# Altium schematic sheet DUT_ATMEGA328P-AU.SchDoc
size A4; SheetNumber: 1; SheetTotal: 1
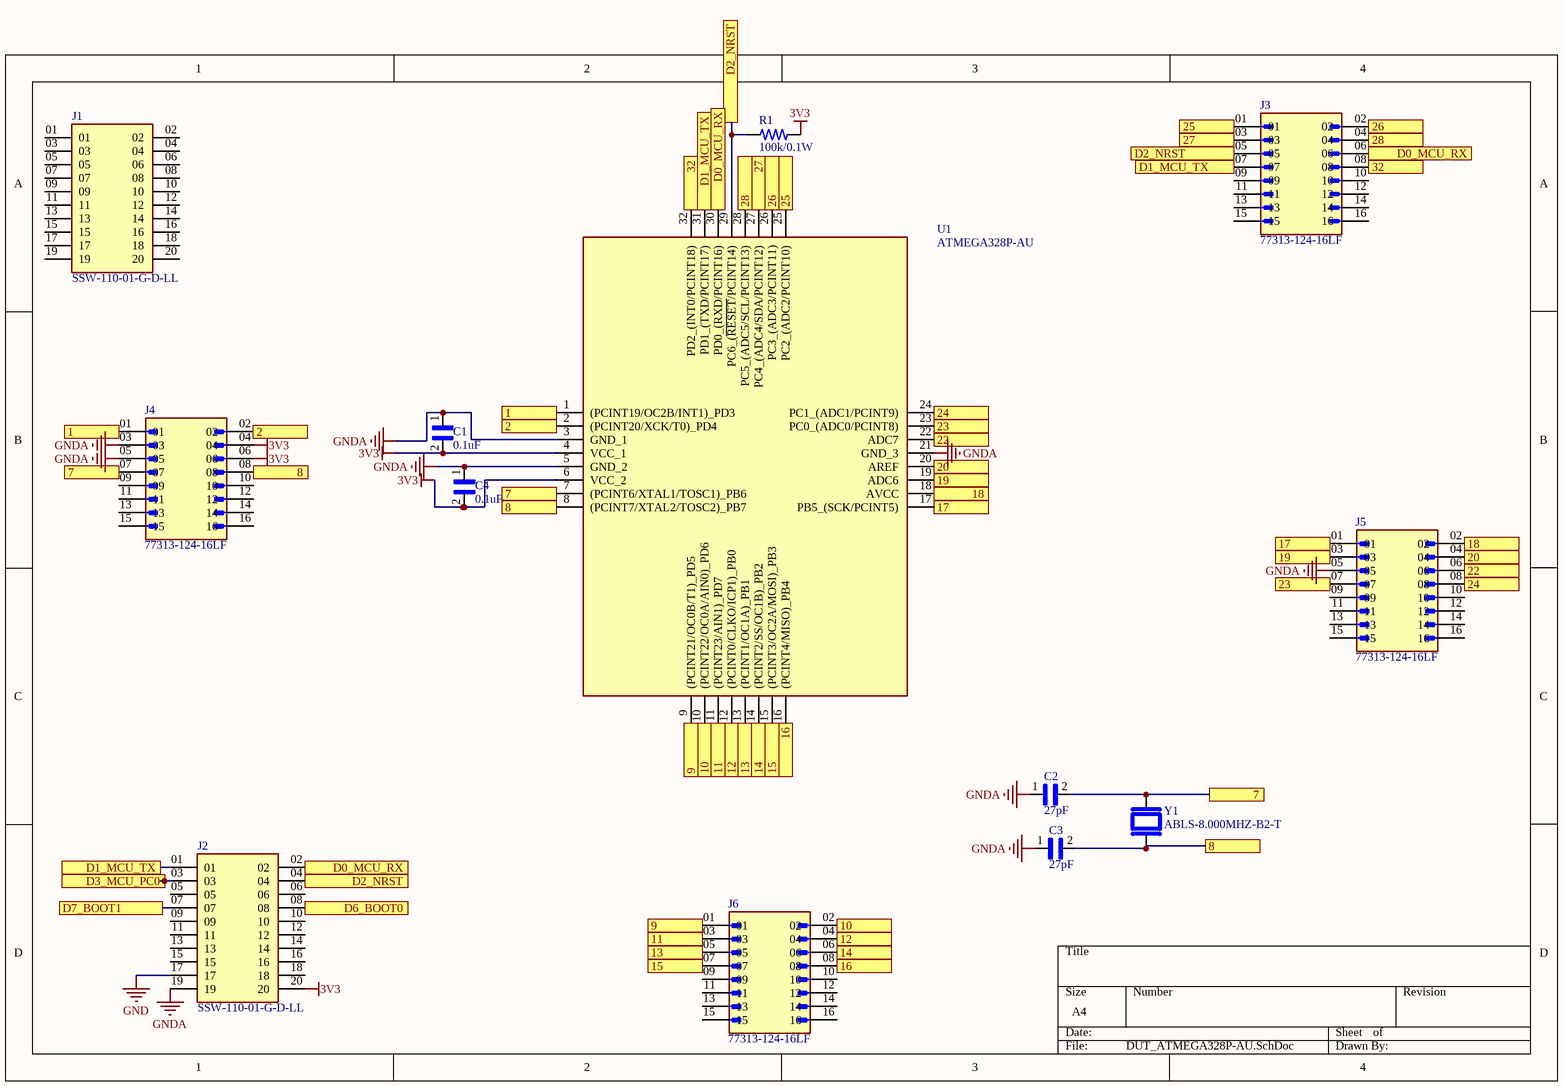
[diagram p0: DUT_ATMEGA328P-AU.SchDoc]

## Parts
C1  0.1uF  [CAPC1608X90]
C2  27pF  [CAPC1608X90]
C3  27pF  [CAPC1608X90]
C4  0.1uF  [CAPC1608X90]
J1  SSW-110-01-G-D-LL  [SAMTEC_SSW-110-01-G-D-LL]
J2  SSW-110-01-G-D-LL  [SAMTEC_SSW-110-01-G-D-LL]
J3  77313-124-16LF  [AMPHENOL_77313-124-16LF]
J4  77313-124-16LF  [AMPHENOL_77313-124-16LF]
J5  77313-124-16LF  [AMPHENOL_77313-124-16LF]
J6  77313-124-16LF  [AMPHENOL_77313-124-16LF]
R1  100k/0.1W  [RESC1608X50N]
U1  ATMEGA328P-AU  [QFP80P900X900X120-32N]
Y1  ABLS-8.000MHZ-B2-T  [XTAL_ABLS-8.000MHZ-B2-T]

## Ports
1 (see DUT_ATMEGA328P-AU[1B]), 1 (see DUT_ATMEGA328P-AU[2B]), 2 (see DUT_ATMEGA328P-AU[1B]), 2 (see DUT_ATMEGA328P-AU[2B]), 7 (see DUT_ATMEGA328P-AU[1B], DUT_ATMEGA328P-AU[2B]), 7 (see DUT_ATMEGA328P-AU[1B], DUT_ATMEGA328P-AU[4C]), 7 (see DUT_ATMEGA328P-AU[2B], DUT_ATMEGA328P-AU[4C]), 8 (see DUT_ATMEGA328P-AU[1B], DUT_ATMEGA328P-AU[2B]), 8 (see DUT_ATMEGA328P-AU[1B], DUT_ATMEGA328P-AU[4D]), 8 (see DUT_ATMEGA328P-AU[2B], DUT_ATMEGA328P-AU[4D]), 9 (see DUT_ATMEGA328P-AU[2C]), 9 (see DUT_ATMEGA328P-AU[2D]), 10 (see DUT_ATMEGA328P-AU[2C]), 10 (see DUT_ATMEGA328P-AU[3D]), 11 (see DUT_ATMEGA328P-AU[2C]), 11 (see DUT_ATMEGA328P-AU[2D]), 12 (see DUT_ATMEGA328P-AU[2C]), 12 (see DUT_ATMEGA328P-AU[3D]), 13 (see DUT_ATMEGA328P-AU[2C]), 13 (see DUT_ATMEGA328P-AU[2D]), 14 (see DUT_ATMEGA328P-AU[2C]), 14 (see DUT_ATMEGA328P-AU[3D]), 15 (see DUT_ATMEGA328P-AU[2C]), 15 (see DUT_ATMEGA328P-AU[2D]), 16 (see DUT_ATMEGA328P-AU[3C]), 16 (see DUT_ATMEGA328P-AU[3D]), 17 (see DUT_ATMEGA328P-AU[3B]), 17 (see DUT_ATMEGA328P-AU[4B]), 18 (see DUT_ATMEGA328P-AU[3B]), 18 (see DUT_ATMEGA328P-AU[4B]), 19 (see DUT_ATMEGA328P-AU[3B]), 19 (see DUT_ATMEGA328P-AU[4B]), 20 (see DUT_ATMEGA328P-AU[3B]), 20 (see DUT_ATMEGA328P-AU[4B]), 22 (see DUT_ATMEGA328P-AU[3B]), 22 (see DUT_ATMEGA328P-AU[4C]), 23 (see DUT_ATMEGA328P-AU[3B]), 23 (see DUT_ATMEGA328P-AU[4C]), 24 (see DUT_ATMEGA328P-AU[3B]), 24 (see DUT_ATMEGA328P-AU[4C]), 25 (see DUT_ATMEGA328P-AU[3A]), 25 (see DUT_ATMEGA328P-AU[4A]), 26 (see DUT_ATMEGA328P-AU[2A]), 26 (see DUT_ATMEGA328P-AU[4A]), 27 (see DUT_ATMEGA328P-AU[2A]), 27 (see DUT_ATMEGA328P-AU[4A]), 28 (see DUT_ATMEGA328P-AU[2A]), 28 (see DUT_ATMEGA328P-AU[4A]), 32 (see DUT_ATMEGA328P-AU[2A]), 32 (see DUT_ATMEGA328P-AU[4A]), D0_MCU_RX (see DUT_ATMEGA328P-AU[1D], DUT_ATMEGA328P-AU[2A]), D0_MCU_RX (see DUT_ATMEGA328P-AU[1D], DUT_ATMEGA328P-AU[4A]), D0_MCU_RX (see DUT_ATMEGA328P-AU[2A], DUT_ATMEGA328P-AU[4A]), D1_MCU_TX (see DUT_ATMEGA328P-AU[1D], DUT_ATMEGA328P-AU[2A]), D1_MCU_TX (see DUT_ATMEGA328P-AU[1D], DUT_ATMEGA328P-AU[3A]), D1_MCU_TX (see DUT_ATMEGA328P-AU[2A], DUT_ATMEGA328P-AU[3A]), D2_NRST (see DUT_ATMEGA328P-AU[1D], DUT_ATMEGA328P-AU[2A]), D2_NRST (see DUT_ATMEGA328P-AU[1D], DUT_ATMEGA328P-AU[3A]), D2_NRST (see DUT_ATMEGA328P-AU[2A], DUT_ATMEGA328P-AU[3A]), D3_MCU_PC0, D6_BOOT0, D7_BOOT1

## Nets
3V3: C1.2 C4.2 J2.20 J4.04 J4.06 R1.2 U1.4(VCC_1) U1.6(VCC_2)
GND: J2.17
GNDA: C1.1 C2.1 C3.1 C4.1 J2.19 J4.03 J4.05 J5.05 U1.3(GND_1) U1.5(GND_2) U1.21(GND_3)
1: J4.01 U1.1((PCINT19/OC2B/INT1)_PD3) ; port 1
2: J4.02 U1.2((PCINT20/XCK/T0)_PD4) ; port 2
7: C2.2 J4.07 U1.7((PCINT6/XTAL1/TOSC1)_PB6) Y1.1 ; port 7
8: C3.2 J4.08 U1.8((PCINT7/XTAL2/TOSC2)_PB7) Y1.2 ; port 8
9: J6.01 U1.9((PCINT21/OC0B/T1)_PD5) ; port 9
10: J6.02 U1.10((PCINT22/OC0A/AIN0)_PD6) ; port 10
11: J6.03 U1.11((PCINT23/AIN1)_PD7) ; port 11
12: J6.04 U1.12((PCINT0/CLKO/ICP1)_PB0) ; port 12
13: J6.05 U1.13((PCINT1/OC1A)_PB1) ; port 13
14: J6.06 U1.14((PCINT2/SS/OC1B)_PB2) ; port 14
15: J6.07 U1.15((PCINT3/OC2A/MOSI)_PB3) ; port 15
16: J6.08 U1.16((PCINT4/MISO)_PB4) ; port 16
17: J5.01 U1.17(PB5_(SCK/PCINT5)) ; port 17
18: J5.02 U1.18(AVCC) ; port 18
19: J5.03 U1.19(ADC6) ; port 19
20: J5.04 U1.20(AREF) ; port 20
22: J5.06 U1.22(ADC7) ; port 22
23: J5.07 U1.23(PC0_(ADC0/PCINT8)) ; port 23
24: J5.08 U1.24(PC1_(ADC1/PCINT9)) ; port 24
25: J3.01 U1.25(PC2_(ADC2/PCINT10)) ; port 25
26: J3.02 U1.26(PC3_(ADC3/PCINT11)) ; port 26
27: J3.03 U1.27(PC4_(ADC4/SDA/PCINT12)) ; port 27
28: J3.04 U1.28(PC5_(ADC5/SCL/PCINT13)) ; port 28
32: J3.08 U1.32(PD2_(INT0/PCINT18)) ; port 32
D0_MCU_RX: J2.02 J3.06 U1.30(PD0_(RXD/PCINT16)) ; port D0_MCU_RX
D1_MCU_TX: J2.01 J3.07 U1.31(PD1_(TXD/PCINT17)) ; port D1_MCU_TX
D2_NRST: J2.04 J3.05 R1.1 U1.29(PC6_(~{RESET}/PCINT14)) ; port D2_NRST
D3_MCU_PC0: J2.03 ; port D3_MCU_PC0
D6_BOOT0: J2.08 ; port D6_BOOT0
D7_BOOT1: J2.07 ; port D7_BOOT1

Not connected (* = marked no-connect by the designer): J1 01 02 03 04 05 06 07 08 09 10 11 12 13 14 15 16 17 18 19 20; J2 05 06 09 10 11 12 13 14 15 16 18; J3 09 10 11 12 13 14 15 16; J4 09 10 11 12 13 14 15 16; J5 09 10 11 12 13 14 15 16; J6 09 10 11 12 13 14 15 16

## Library data of the parts
C1 C4 = CC0603MRX5R7BB106: CAP CER 10UF 16V X5R 0603; Package: None; Price: None; Value: *; MP: CC0603MRX5R7BB106; Availability: Unavailable
C2 C3 = CC0603MRX5R7BB106: 0603; Package: None; Price: None; Value: *; MP: CC0603MRX5R7BB106; Availability: Unavailable
J1 J2 = SSW-110-01-G-D-LL: MF: Samtec Inc.; Value: *; Availability: Unavailable; Package: None; Price: None; MP: SSW-110-01-G-D-LL
J3-J6 = 77313-124-16LF: BergStikÂ®, Board to Board connector, Unshrouded Header, 2.54 mm Pitch, Vertical, Double Row,Through Hole, 16 Positions; MF: Amphenol ICC (FCI); SnapEDA_Link: https://www.snapeda.com/parts/77313-124-16LF/Amphenol+FCI/view-part/?ref=snap; Package: None; Value: *; MP: 77313-124-16LF; Check_prices: https://www.snapeda.com/parts/77313-124-16LF/Amphenol+FCI/view-part/?ref=eda
R1 = 3-1879460-5: RES 0.27 OHM 1% 1/10W 0603; Power_Rating: .1 W; Resistance: 27; MF: TE Connectivity; SnapEDA_Link: https://www.snapeda.com/parts/3-1879460-5/TE+Connectivity/view-part/?ref=snap; MP: 3-1879460-5; Package: 0603; Check_prices: https://www.snapeda.com/parts/3-1879460-5/TE+Connectivity/view-part/?ref=eda; EU_RoHS_Compliance: Compliant with Exemptions; Price: None; Tolerance: 1%; Availability: In Stock; Value: *
U1 = ATMEGA328P-AU: MICROCHIP - ATMEGA328P-AU. - MICROCONTROLLER MCU, 8 BIT, ATMEGA, 20MHZ, TQFP-32; Geometry.Height: 1.2mm; Mouser Part Number: 556-ATMEGA328P-AU; Mouser Price/Stock: https://www.mouser.co.uk/ProductDetail/Microchip-Technology/ATMEGA328P-AU?qs=K8BHR703ZXiCmmgp6%2FGNmQ%3D%3D; Manufacturer_Name: Microchip; Manufacturer_Part_Number: ATMEGA328P-AU; Datasheet Link: https://componentsearchengine.com/Datasheets/2/ATMEGA328P-AU.pdf
Y1 = ABLS-8.000MHZ-B2-T: HC/49US (AT49) SMD LOW PROFILE CRYSTAL; MF: Abracon LLC; Availability: In Stock; Purchase-URL: https://pricing.snapeda.com/search/part/ABLS-8.000MHZ-B2-T/?ref=eda; Package: HC49/US Abracon; MP: ABLS-8.000MHZ-B2-T; Value: *; Check_prices: https://www.snapeda.com/parts/ABLS-8.000MHZ-B2-T/Abracon+LLC/view-part/?ref=eda; SnapEDA_Link: https://www.snapeda.com/parts/ABLS-8.000MHZ-B2-T/Abracon+LLC/view-part/?ref=snap; Price: None